# Altium schematic sheet NODE_DW1000_A_V2.SchDoc: PDOA Kit Node
size A3; Date: 07/12/16; Organization: Decawave Ltd.; Address1: Adelaide Chambers,; Address2: Peter Street,; Address3: Dublin 8,; Address4: Ireland.; DocumentNumber: 3; Revision: 2v2; SheetNumber: 3; SheetTotal: 5; SheetFunction: DW1002 A; ProjectName: PDOA Kit Node
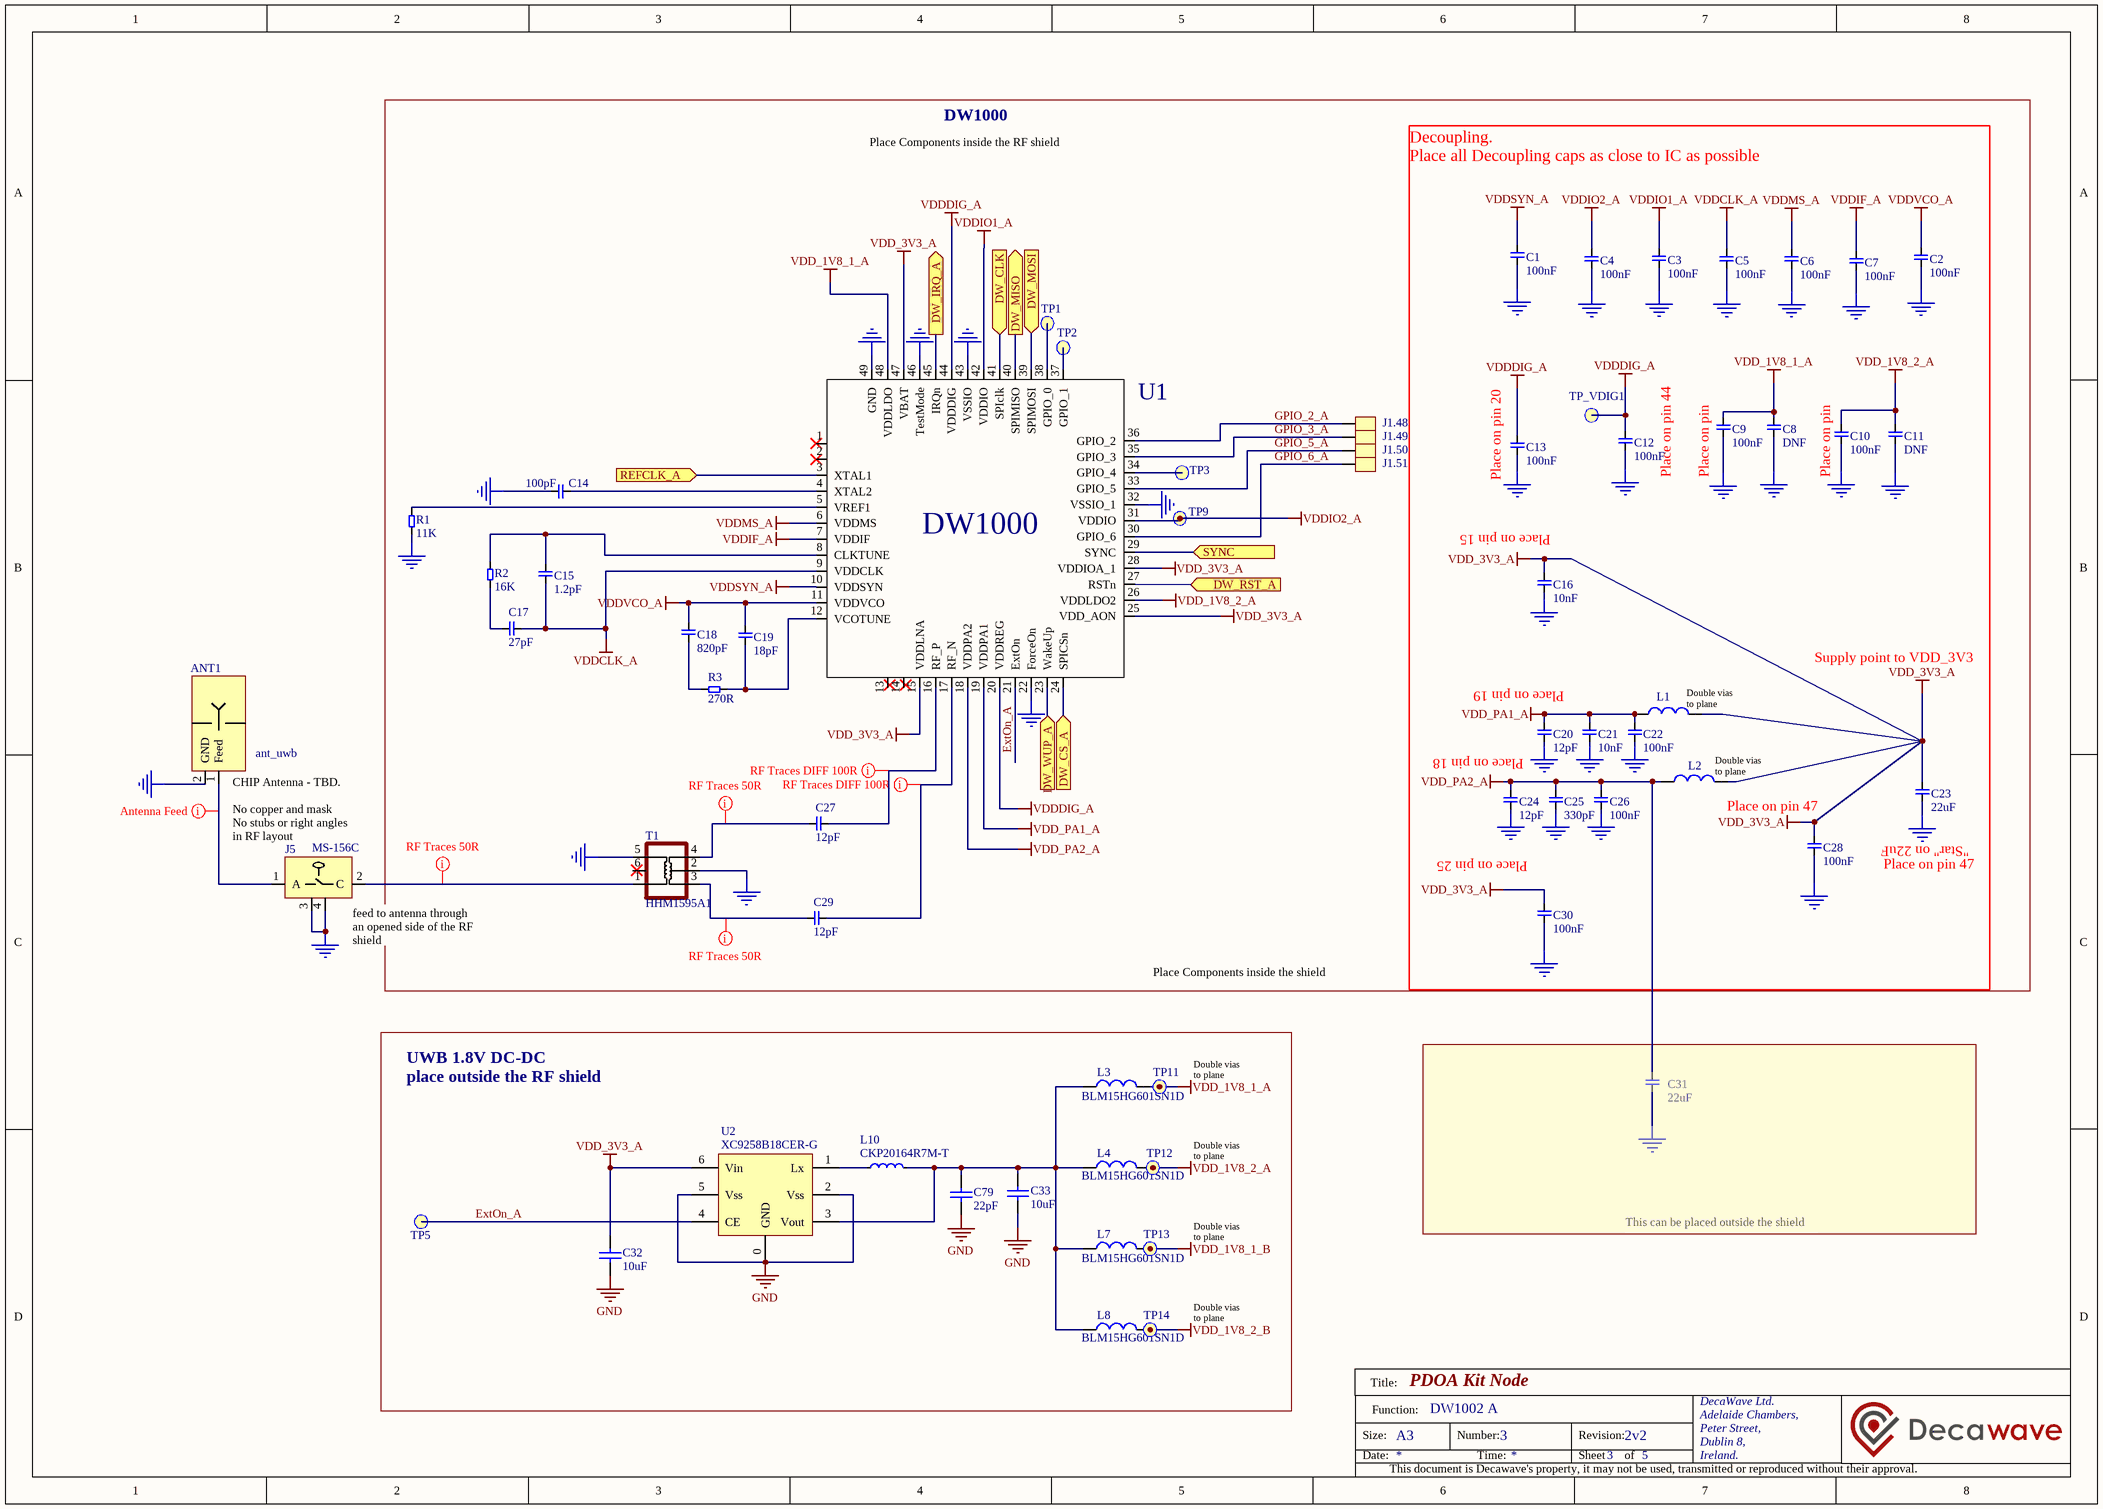
[diagram p0: NODE_DW1000_A_V2.SchDoc]

## Parts
ANT1  ant_uwb  [ANT]
C1  100nF  [C0201-C]
C2  100nF  [C0201-C]
C3  100nF  [C0201-C]
C4  100nF  [C0201-C]
C5  100nF  [C0201-C]
C6  100nF  [C0201-C]
C7  100nF  [C0201-C]
C8  DNF  [C0402]
C9  100nF  [C0201-C]
C10  100nF  [C0201-C]
C11  DNF  [C0402]
C12  100nF  [C0201-C]
C13  100nF  [C0201-C]
C14  100pF  [C0402]
C15  1.2pF  [C0201-C]
C16  10nF  [C0201-C]
C17  27pF  [C0201-C]
C18  820pF  [C0402]
C19  18pF  [C0201-C]
C20  12pF  [C0201-C]
C21  10nF  [C0201-C]
C22  100nF  [C0201-C]
C23  22uF  [C0603]
C24  12pF  [C0201-C]
C25  330pF  [C0201-C]
C26  100nF  [C0201-C]
C27  12pF  [C0201-C]
C28  100nF  [C0201-C]
C29  12pF  [C0201-C]
C30  100nF  [C0201-C]
C31  22uF  [C0603]
C32  10uF  [C0603]
C33  10uF  [C0603]
C79  22pF  [C0201]
J1.48  EDGE_PIN  [PCB_EDGE_1MM]  (value not drawn)
J1.49  EDGE_PIN  [PCB_EDGE_1MM]  (value not drawn)
J1.50  EDGE_PIN  [PCB_EDGE_1MM]  (value not drawn)
J1.51  EDGE_PIN  [PCB_EDGE_1MM]  (value not drawn)
J5  Manufacturer Part Number: MS-156C  [RF_SWITCH_2P3X2P3]  (hidden comment: coswitch)
L1  BLM15HG601SN1D  [L0402]  (value not drawn)
L2  BLM15HG601SN1D  [L0402]  (value not drawn)
L3  BLM15HG601SN1D  [L0402]
L4  BLM15HG601SN1D  [L0402]
L7  BLM15HG601SN1D  [L0402]
L8  BLM15HG601SN1D  [L0402]
L10  CKP20164R7M-T  [INDC2016X10N]
R1  11K  [R0201-C]
R2  16K  [R0201-C]
R3  270R  [R0201-C]
T1  HHM1595A1  [TRANS4_0P65_2P15X1P4]
TP1  TP  [TP_40S]  (value not drawn)
TP2  TP  [TP_40S]  (value not drawn)
TP3  TP  [TP_40S]  (value not drawn)
TP5  TP  [TP_40S]  (value not drawn)
TP9  TP  [TP_40S]  (value not drawn)
TP11  TP  [TP_40S]  (value not drawn)
TP12  TP  [TP_40S]  (value not drawn)
TP13  TP  [TP_40S]  (value not drawn)
TP14  TP  [TP_40S]  (value not drawn)
TP_VDIG1  TP  [TP_40S]  (value not drawn)
U1  DW1000 IC  [QFN48_0P4_6P0X6P0_T]  (value not drawn)
U2  XC9258B18CER-G  [USP-6C]

## Blocks framed on the sheet
DW1000: C1-C30 J1.48-J1.51 L1 L2 R1-R3 T1 TP1-TP3 TP9 TP_VDIG1 U1

## Ports
DW_CLK (in), DW_CS_A (in), DW_IRQ_A (out), DW_MISO (out), DW_MOSI (in), DW_RST_A (in), DW_WUP_A (in), REFCLK_A (in), SYNC (in)

## Nets
GND: ANT1.2(GND) C1.1 C2.1 C3.1 C4.1 C5.1 C6.1 C7.1 C8.1 C9.1 C10.1 C11.1 C12.1 C13.1 C14.2 C16.1 C20.1 C21.1 C22.1 C23.1 C24.1 C25.1 C26.1 C28.1 C30.1 C31.1 C32.1 C33.1 C79.1 J5.3(GND) J5.4(GND) R1.1 T1.2 T1.5 U1.22(ForceOn) U1.32(VSSIO_1) U1.43(VSSIO) U1.46(TestMode) U1.49(GND) U2.0(GND) U2.2(Vss) U2.5(Vss)
VDD_1V8_1_A: C8.2 C9.2 L3.2 TP11.1 U1.48(VDDLDO)
VDD_1V8_1_B: L7.2 TP13.1
VDD_1V8_2_A: C10.2 C11.2 L4.2 TP12.1 U1.26(VDDLDO2)
VDD_1V8_2_B: L8.2 TP14.1
VDD_3V3_A: C16.2 C23.2 C28.2 C30.2 C32.2 L1.2 L2.2 U1.15(VDDLNA) U1.25(VDD_AON) U1.28(VDDIOA_1) U1.47(VBAT) U2.6(Vin)
VDD_PA1_A: C20.2 C21.2 C22.2 L1.1 U1.19(VDDPA1)
VDD_PA2_A: C24.2 C25.2 C26.2 C31.2 L2.1 U1.18(VDDPA2)
VDDCLK_A: C5.2 C15.1 C17.1 U1.9(VDDCLK)
VDDDIG_A: C12.2 C13.2 TP_VDIG1.1 U1.20(VDDREG) U1.44(VDDDIG)
VDDIF_A: C7.2 U1.7(VDDIF)
VDDIO1_A: C3.2 U1.42(VDDIO)
VDDIO2_A: C4.2 TP9.1 U1.31(VDDIO)
VDDMS_A: C6.2 U1.6(VDDMS)
VDDSYN_A: C1.2 U1.10(VDDSYN)
VDDVCO_A: C2.2 C18.2 C19.1 U1.11(VDDVCO)
DW_CLK: U1.41(SPIclk) ; port DW_CLK
DW_CS_A: U1.24(SPICSn) ; port DW_CS_A
DW_IRQ_A: U1.45(IRQn) ; port DW_IRQ_A
DW_MISO: U1.40(SPIMISO) ; port DW_MISO
DW_MOSI: U1.39(SPIMOSI) ; port DW_MOSI
DW_RST_A: U1.27(RSTn) ; port DW_RST_A
DW_WUP_A: U1.23(WakeUp) ; port DW_WUP_A
ExtOn_A: TP5.1 U1.21(ExtOn) U2.4(CE)
GPIO_2_A: J1.48.0 U1.36(GPIO_2)
GPIO_3_A: J1.49.0 U1.35(GPIO_3)
GPIO_5_A: J1.50.0 U1.33(GPIO_5)
GPIO_6_A: J1.51.0 U1.30(GPIO_6)
REFCLK_A: U1.3(XTAL1) ; port REFCLK_A
SYNC: U1.29(SYNC) ; port SYNC
NetANT1_1: ANT1.1(Feed) J5.1(A)
NetC14_1: C14.1 U1.4(XTAL2)
NetC15_2: C15.2 R2.2 U1.8(CLKTUNE)
NetC17_2: C17.2 R2.1
NetC18_1: C18.1 R3.2
NetC19_2: C19.2 R3.1 U1.12(VCOTUNE)
NetC27_1: C27.1 T1.4
NetC27_2: C27.2 U1.16(RF_P)
NetC29_1: C29.1 T1.3
NetC29_2: C29.2 U1.17(RF_N)
NetC33_2: C33.2 C79.2 L3.1 L4.1 L7.1 L8.1 L10.2 U2.3(Vout)
NetJ5_2: J5.2(C) T1.1
NetL10_1: L10.1 U2.1(Lx)
NetR1_2: R1.2 U1.5(VREF1)
NetTP1_1: TP1.1 U1.38(GPIO_0)
NetTP2_1: TP2.1 U1.37(GPIO_1)
NetTP3_1: TP3.1 U1.34(GPIO_4)

Not connected (* = marked no-connect by the designer): T1 6; U1 1* 2* 13 14

## Layout directives
net class RF Traces 50R: NetC27_1, NetC27_2, NetC29_1, NetC29_2, NetJ5_2
net class Antenna Feed: NetANT1_1

## Notes on the sheet
- Place Components inside the RF shield
- (near C13) Place on pin 20
- Place on pin 44
- (near C9) Place on pin
- (near C10) Place on pin
- (near C16) Place on pin 15
- Place on pin 19
- (near L1) Double vias
  to plane
- Supply point to VDD_3V3
- Place on pin 18
- (near L2) Double vias
  to plane
- (near ANT1) CHIP Antenna - TBD.
  No copper and mask
  No stubs or right angles in RF layout
- Place on pin 25
- Place on pin 47
- "Star" on 22uF
- (near J5) feed to antenna through an opened side of the RF shield
- Place Components inside the shield
- Decoupling.
  Place all Decoupling caps as close to IC as possible
- UWB 1.8V DC-DC
  place outside the RF shield
- (near TP11) Double vias
  to plane
- Double vias
  to plane
- This can be placed outside the shield
- Title:
- Size:
- Date:
- Function:
- A3
- Number:
- Time:
- Revision:
- Sheet
- of
- DecaWave Ltd.
- Adelaide Chambers,
- Peter Street,
- Dublin 8,
- Ireland.
- This document is Decawave's property, it may not be used, transmitted or reproduced without their approval.

## Library data of the parts
ANT1 = M10044: CHIP ANT
C1-C7 C9 C10 C12 C13 C22 C26 C28 C30 = C10051: 100nF_0201_10%; Manufacturer: Murata Electronics North America; Manufacturer Part Number: GRM033C81E104KE14D
C8 C11 = C10007: 4.7uF_0402_10%; Manufacturer: TDK; Manufacturer Part Number: C1005X5R0J475K050BC
C14 = C10017: 100pF_0402_10%; Manufacturer Part Number: GRM1555C1H101JA01D; Manufacturer: Murata Electronics North America
C15 = C10056: 1.2pF_0201_10%; Manufacturer: Murata Electronics North America; Manufacturer Part Number: GRM0335C1E1R2CA01D
C16 C21 = C10062: 10nF_0201_10%; Manufacturer: Murata Electronics North America; Manufacturer Part Number: GRM033R61E103KA12D
C17 = C10057: 27pF_0201_2%; Manufacturer: Murata Electronics North America; Manufacturer Part Number: GRM0335C1E270JA01D
C18 = C10054: 820pF_0201_2%; Manufacturer: Murata Electronics North America; Manufacturer Part Number: GRM033R71E821KA01D
C19 = C10053: 18pF_0201_1%; Manufacturer: Murata Electronics North America; Manufacturer Part Number: GRM0335C1H180JA01D
C20 C24 C27 C29 = C10060: 12pF_0201_1%; Manufacturer: Murata Electronics North America; Manufacturer Part Number: GRM0335C1E120JA01D
C23 C31 = C10059: 22uF_0603_10%; Manufacturer: Murata Electronics North America; Manufacturer Part Number: GRM188R60J226MEA0D
C25 = C10061: 330pF_0201_10%; Manufacturer: SamSung; Manufacturer Part Number: CL03B331KA3NNNC
C32 C33 = GRM188R60J106ME84D: CAP CER 10UF 6.3V X5R 0603; Manufacturer: Murata Electronics North America; Manufacturer Part Number: GRM188R60J106ME47D
C79 = GRM0335C1E100JA01D: CAP CER 10PF 25V NP0 0201; Manufacturer: Murata Electronics North America; Manufacturer Part Number: GRM0335C1E220JA01D; Failure Rate: *
J1.48-J1.51 = EDGE_PIN: PCB Edge pin
J5 = J10015: COAX JACK STR 50 OHM SMD; Manufacturer: Hirose
L1-L4 L7 L8 = M10012: FERRITE BEAD, 0.7OHM, 300MA, 0402; Manufacturer: Murata Electronics North America; Manufacturer Part Number: BLM15HG601SN1D
L10 = CKP20162R2M-T: FIXED IND 2.2UH 1.2A 110 MOHM; Manufacturer: Taiyo Yuden; Manufacturer Part Number: CKP20162R2M-T
R1 = R10051: 11K_0201_1%; Manufacturer: Yageo; Manufacturer Part Number: RC0201FR-0711KL
R2 = R10054: 16K_0201_1%; Manufacturer: Yageo; Manufacturer Part Number: RC0201FR-0716KL
R3 = R10050: 270R_0201_1%; Manufacturer: Yageo; Manufacturer Part Number: RC0201FR-07270RL
T1 = M10043: SMT UWB Balun 3-8Ghz; Manufacturer: TDK; Manufacturer Part Number: HHM1595A1
TP1-TP3 TP5 TP9 TP11-TP14 TP_VDIG1 = TP: test point
U1 = U10000: UMB Transceiver; Manufacturer: Decawave; Manufacturer Part Number: DW1000
U2 = XC9257/8: Manufacturer: Torex; Manufacturer Part Number: XC9258B18CER-G